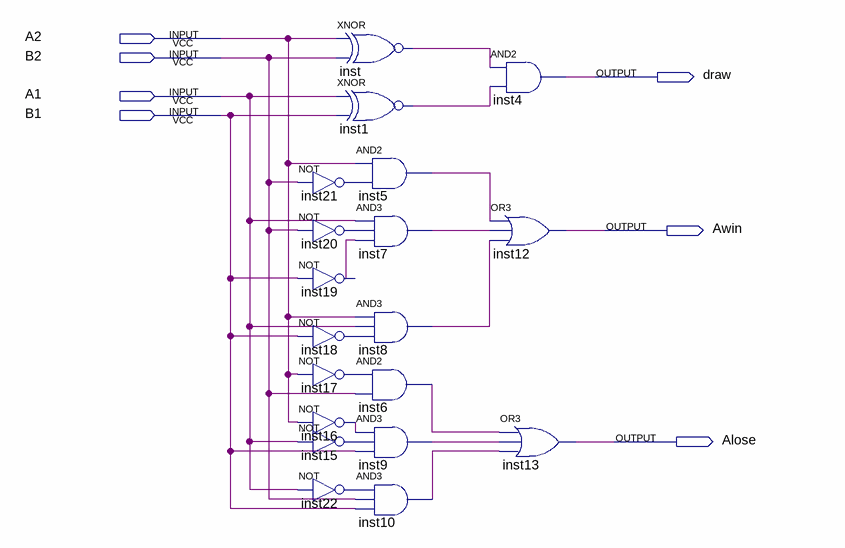
[diagram p0: schematic sheet]
// Quartus schematic two_bit_compare.bdf as structural Verilog: 19 symbols, 7 pins
module two_bit_compare (
  input  A2,
  input  B2,
  input  A1,
  input  B1,
  output draw,
  output Awin,
  output Alose
);

  wire inst1_out, inst5_out, inst6_out, inst7_out, inst8_out, inst9_out, inst10_out, inst15_out, inst16_out,
       inst17_out, inst18_out, inst19_out, inst20_out, inst21_out, inst22_out, inst_out;

  not inst21 (inst21_out, B2);
  not inst20 (inst20_out, B2);
  not inst19 (inst19_out, B1);
  not inst18 (inst18_out, B1);
  not inst17 (inst17_out, A2);
  not inst16 (inst16_out, A2);
  not inst15 (inst15_out, A1);
  not inst22 (inst22_out, A1);
  xnor inst (inst_out, A2, B2);
  xnor inst1 (inst1_out, A1, B1);
  and inst5 (inst5_out, A2, inst21_out);
  and inst7 (inst7_out, A1, inst20_out, inst19_out);
  and inst8 (inst8_out, A2, A1, inst18_out);
  and inst6 (inst6_out, inst17_out, B2);
  and inst9 (inst9_out, inst16_out, inst15_out, B1);
  and inst10 (inst10_out, inst22_out, B2, B1);
  and inst4 (draw, inst_out, inst1_out);
  or inst12 (Awin, inst5_out, inst7_out, inst8_out);
  or inst13 (Alose, inst6_out, inst9_out, inst10_out);
endmodule
